# Altium schematic sheet S04.SchDoc: IEEE-1394/Ethernet FPGA Controller
size 381 x 254 mm; Revision: 3.2; SheetNumber: 4; SheetTotal: 10
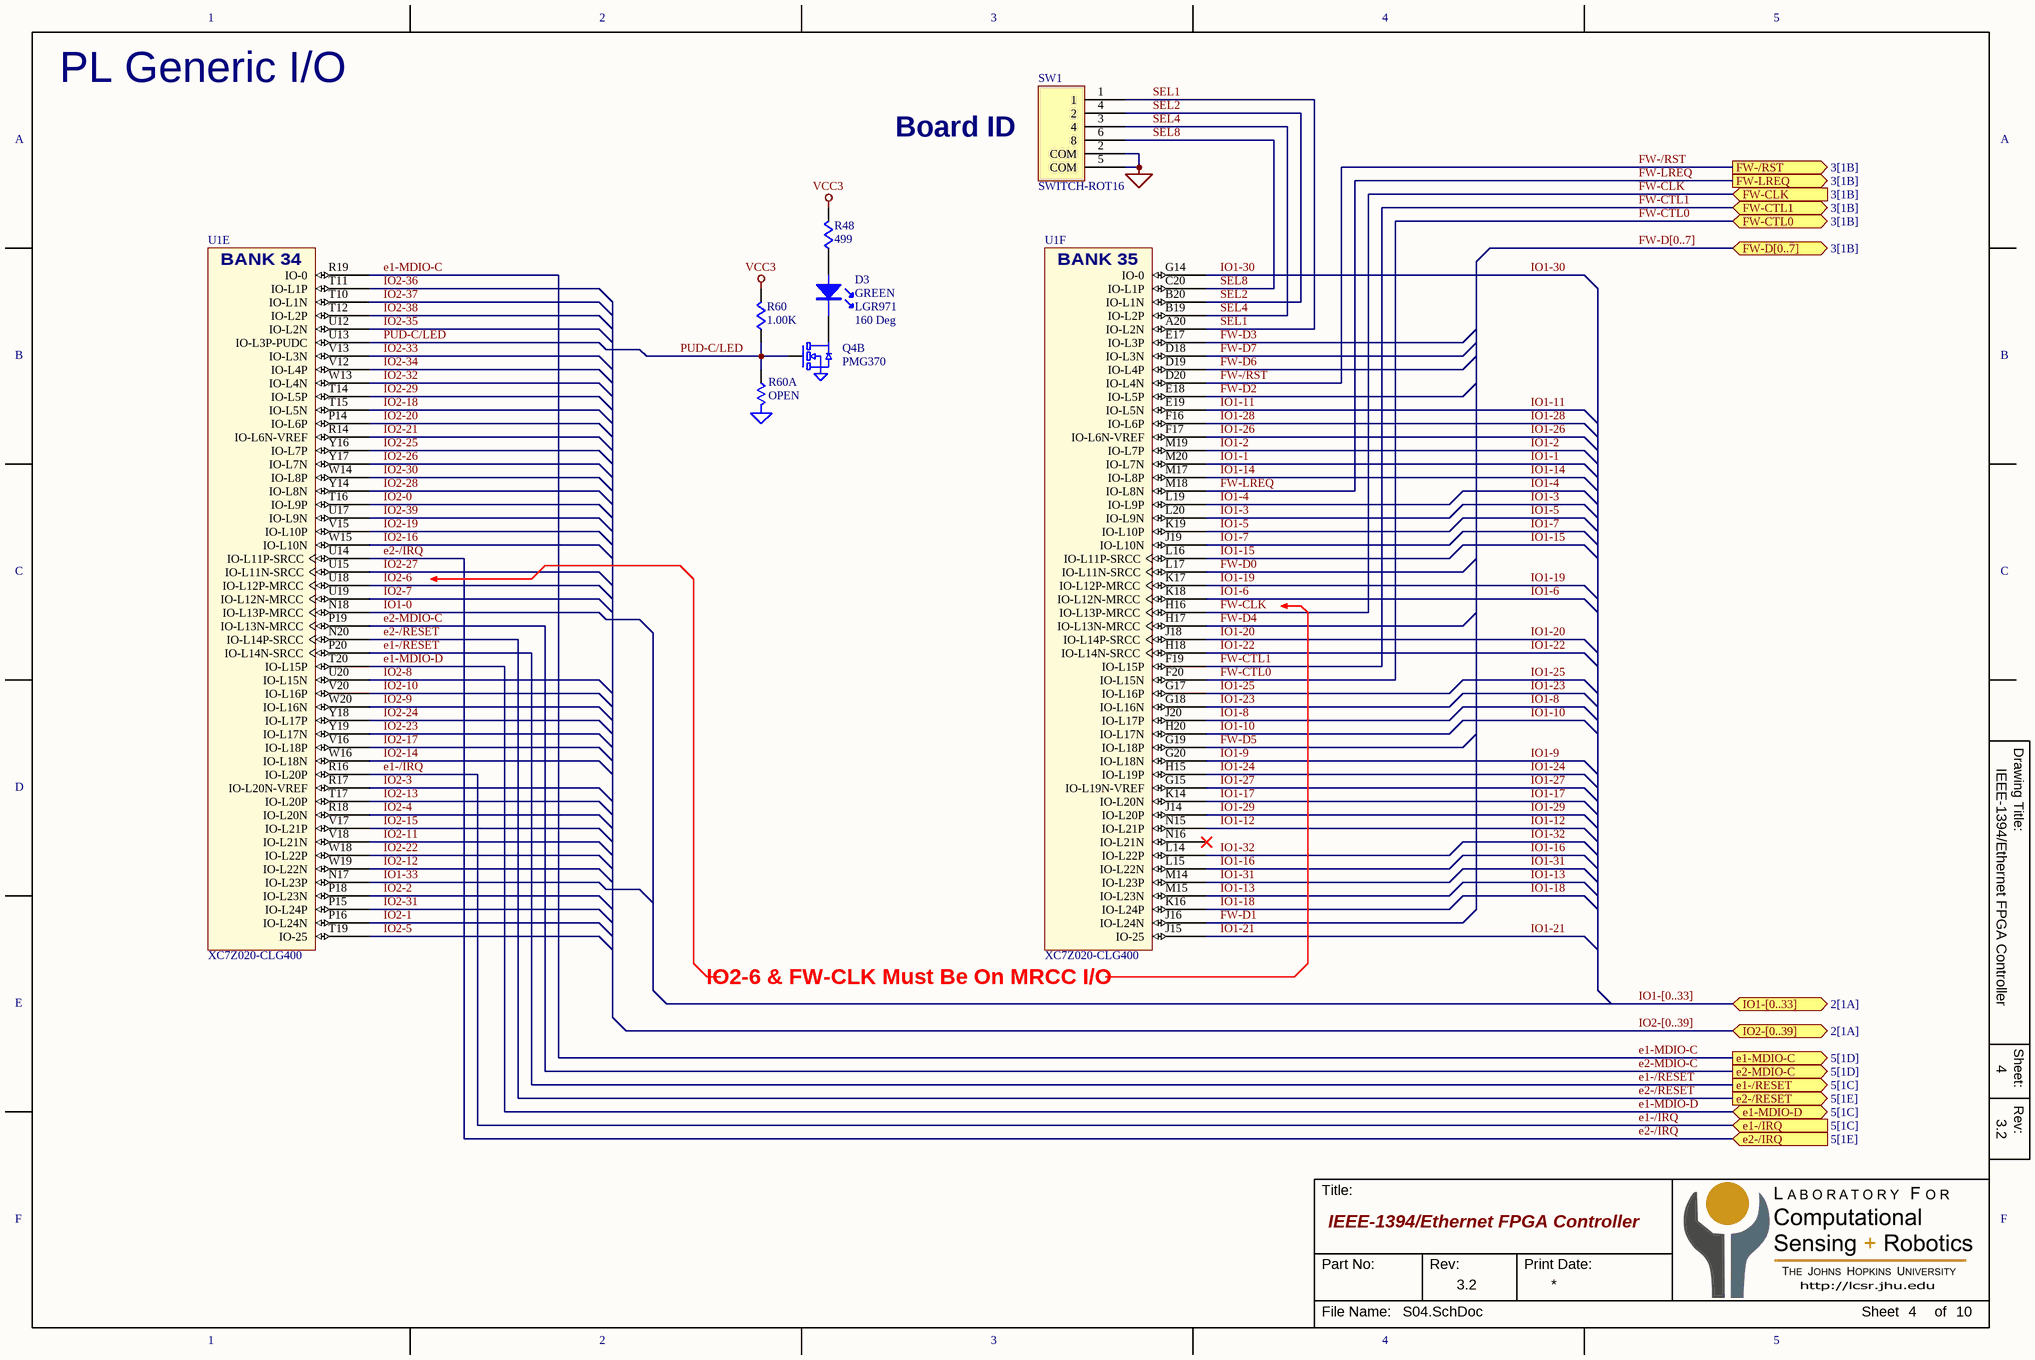
[diagram p0: S04.SchDoc]

## Parts
D3  Color: GREEN  P/N: LGR971  Angle: 160 Deg  [LED-0805]  (hidden comment: LED)
Q4  PMG370  [SC70-6-NP]  (part B of 2)
R48  499  [R0402]
R60  1.00K  [R0402]
R60A  OPEN  [R0402]
SW1  SWITCH-ROT16  [SW-ROT-10MM-TH]
U1  XC7Z020-CLG400  [BGA-400-08mm]  (parts E,F of 9)

## Ports
e1-/IRQ (in, see 5[1C]), e1-/RESET (out, see 5[1C]), e1-MDIO-C (out, see 5[1D]), e1-MDIO-D (bidir, see 5[1C]), e2-/IRQ (in, see 5[1E]), e2-/RESET (out, see 5[1E]), e2-MDIO-C (out, see 5[1D]), FW-/RST (out, see 3[1B]), FW-CLK (in, see 3[1B]), FW-CTL0 (bidir, see 3[1B]), FW-CTL1 (bidir, see 3[1B]), FW-D[0..7] (bidir, see 3[1B]), FW-LREQ (out, see 3[1B]), IO1-[0..33] (bidir, see 2[1A]), IO2-[0..39] (bidir, see 2[1A])

## Nets
GND: Q4.4(S2) R60A.2(GND) SW1.2(COM) SW1.5(COM)
VCC3: R48.2 R60.2
e1-/IRQ: U1.R16(IO-L20P) ; port e1-/IRQ
e1-/RESET: U1.P20(IO-L14N-SRCC) ; port e1-/RESET
e1-MDIO-C: U1.R19(IO-0) ; port e1-MDIO-C
e1-MDIO-D: U1.T20(IO-L15P) ; port e1-MDIO-D
e2-/IRQ: U1.U14(IO-L11P-SRCC) ; port e2-/IRQ
e2-/RESET: U1.N20(IO-L14P-SRCC) ; port e2-/RESET
e2-MDIO-C: U1.P19(IO-L13N-MRCC) ; port e2-MDIO-C
FW-/RST: U1.D20(IO-L4N) ; port FW-/RST
FW-CLK: U1.H16(IO-L13P-MRCC) ; port FW-CLK
FW-CTL0: U1.F20(IO-L15N) ; port FW-CTL0
FW-CTL1: U1.F19(IO-L15P) ; port FW-CTL1
FW-D0: U1.L17(IO-L11N-SRCC)
FW-D1: U1.J16(IO-L24N)
FW-D2: U1.E18(IO-L5P)
FW-D3: U1.E17(IO-L3P)
FW-D4: U1.H17(IO-L13N-MRCC)
FW-D5: U1.G19(IO-L18P)
FW-D6: U1.D19(IO-L4P)
FW-D7: U1.D18(IO-L3N)
FW-LREQ: U1.M18(IO-L8N) ; port FW-LREQ
IO1-0: U1.N18(IO-L13P-MRCC)
IO1-1: U1.M20(IO-L7N)
IO1-2: U1.M19(IO-L7P)
IO1-3: U1.L20(IO-L9N)
IO1-4: U1.L19(IO-L9P)
IO1-5: U1.K19(IO-L10P)
IO1-6: U1.K18(IO-L12N-MRCC)
IO1-7: U1.J19(IO-L10N)
IO1-8: U1.J20(IO-L17P)
IO1-9: U1.G20(IO-L18N)
IO1-10: U1.H20(IO-L17N)
IO1-11: U1.E19(IO-L5N)
IO1-12: U1.N15(IO-L21P)
IO1-13: U1.M15(IO-L23N)
IO1-14: U1.M17(IO-L8P)
IO1-15: U1.L16(IO-L11P-SRCC)
IO1-16: U1.L15(IO-L22N)
IO1-17: U1.K14(IO-L20N)
IO1-18: U1.K16(IO-L24P)
IO1-19: U1.K17(IO-L12P-MRCC)
IO1-20: U1.J18(IO-L14P-SRCC)
IO1-21: U1.J15(IO-25)
IO1-22: U1.H18(IO-L14N-SRCC)
IO1-23: U1.G18(IO-L16N)
IO1-24: U1.H15(IO-L19P)
IO1-25: U1.G17(IO-L16P)
IO1-26: U1.F17(IO-L6N-VREF)
IO1-27: U1.G15(IO-L19N-VREF)
IO1-28: U1.F16(IO-L6P)
IO1-29: U1.J14(IO-L20P)
IO1-30: U1.G14(IO-0)
IO1-31: U1.M14(IO-L23P)
IO1-32: U1.L14(IO-L22P)
IO1-33: U1.N17(IO-L23P)
IO2-0: U1.T16(IO-L9P)
IO2-1: U1.P16(IO-L24N)
IO2-2: U1.P18(IO-L23N)
IO2-3: U1.R17(IO-L20N-VREF)
IO2-4: U1.R18(IO-L20N)
IO2-5: U1.T19(IO-25)
IO2-6: U1.U18(IO-L12P-MRCC)
IO2-7: U1.U19(IO-L12N-MRCC)
IO2-8: U1.U20(IO-L15N)
IO2-9: U1.W20(IO-L16N)
IO2-10: U1.V20(IO-L16P)
IO2-11: U1.V18(IO-L21N)
IO2-12: U1.W19(IO-L22N)
IO2-13: U1.T17(IO-L20P)
IO2-14: U1.W16(IO-L18N)
IO2-15: U1.V17(IO-L21P)
IO2-16: U1.W15(IO-L10N)
IO2-17: U1.V16(IO-L18P)
IO2-18: U1.T15(IO-L5N)
IO2-19: U1.V15(IO-L10P)
IO2-20: U1.P14(IO-L6P)
IO2-21: U1.R14(IO-L6N-VREF)
IO2-22: U1.W18(IO-L22P)
IO2-23: U1.Y19(IO-L17N)
IO2-24: U1.Y18(IO-L17P)
IO2-25: U1.Y16(IO-L7P)
IO2-26: U1.Y17(IO-L7N)
IO2-27: U1.U15(IO-L11N-SRCC)
IO2-28: U1.Y14(IO-L8N)
IO2-29: U1.T14(IO-L5P)
IO2-30: U1.W14(IO-L8P)
IO2-31: U1.P15(IO-L24P)
IO2-32: U1.W13(IO-L4N)
IO2-33: U1.V13(IO-L3N)
IO2-34: U1.V12(IO-L4P)
IO2-35: U1.U12(IO-L2N)
IO2-36: U1.T11(IO-L1P)
IO2-37: U1.T10(IO-L1N)
IO2-38: U1.T12(IO-L2P)
IO2-39: U1.U17(IO-L9N)
PUD-C/LED: Q4.5(G2) R60.1 R60A.1 U1.U13(IO-L3P-PUDC)
SEL1: SW1.1 U1.A20(IO-L2N)
SEL2: SW1.4(2) U1.B20(IO-L1N)
SEL4: SW1.3(4) U1.B19(IO-L2P)
SEL8: SW1.6(8) U1.C20(IO-L1P)
NetD3_1: D3.1(C) Q4.3(D2)
NetD3_2: D3.2(A) R48.1

Not connected (* = marked no-connect by the designer): U1 N16(IO-L21N)*

## Buses and harness runs
bus FW-D[0..7] = port FW-D[0..7]
bus IO1-[0..33] = port IO1-[0..33]
bus IO2-[0..39] = port IO2-[0..39]

## Notes on the sheet
- PL Generic I/O
- Board ID
- IO2-6 & FW-CLK Must Be On MRCC I/O
- 1
- 2
- 3
- 4
- 5
- A
- B
- C
- Drawing Title:
- D
- E
- Sheet:
- Rev:
- F
- Title:
- Part No:
- Print Date:
- File Name:
- Sheet
- of
- (in symbol XC7Z020-CLG400, part E) BANK 34
- (in symbol XC7Z020-CLG400, part F) BANK 35

## Library data of the parts
Q4 = MOSFET-N-DUAL6
R48 R60 = R
R60A = R-GND